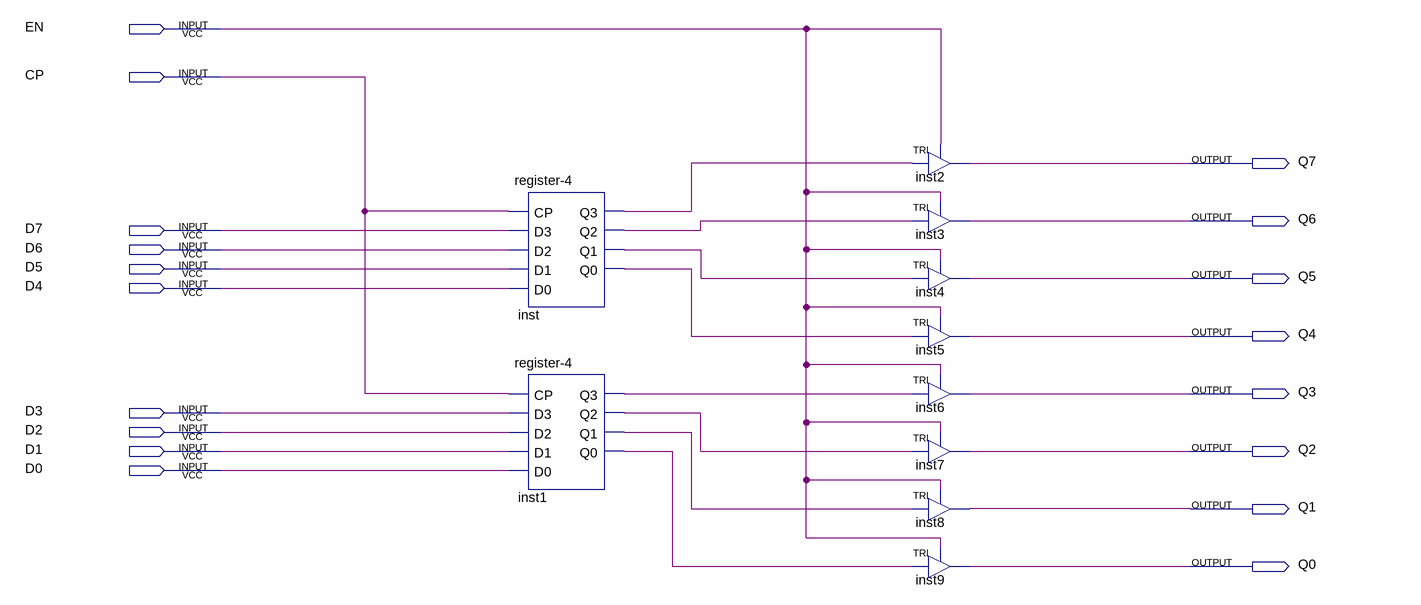
[diagram p0: schematic sheet]
// Quartus schematic register-8-en.bdf as structural Verilog: 10 symbols, 18 pins
module \register-8-en  (
  input  EN,
  input  CP,
  input  D7,
  input  D6,
  input  D5,
  input  D4,
  input  D3,
  input  D2,
  input  D1,
  input  D0,
  output Q7,
  output Q6,
  output Q5,
  output Q4,
  output Q3,
  output Q2,
  output Q1,
  output Q0
);

  wire inst1_q0, inst1_q1, inst1_q2, inst1_q3, inst_q0, inst_q1, inst_q2, inst_q3;

  \register-4  inst (
    .CP(CP), .D3(D7), .D2(D6), .D1(D5), .D0(D4), .Q3(inst_q3), .Q2(inst_q2), .Q1(inst_q1), .Q0(inst_q0));
  \register-4  inst1 (
    .CP(CP), .D3(D3), .D2(D2), .D1(D1), .D0(D0), .Q3(inst1_q3), .Q2(inst1_q2), .Q1(inst1_q1), .Q0(inst1_q0));
  TRI inst2 (.IN(inst_q3), .OE(EN), .OUT(Q7));
  TRI inst3 (.IN(inst_q2), .OE(EN), .OUT(Q6));
  TRI inst4 (.IN(inst_q1), .OE(EN), .OUT(Q5));
  TRI inst5 (.IN(inst_q0), .OE(EN), .OUT(Q4));
  TRI inst6 (.IN(inst1_q3), .OE(EN), .OUT(Q3));
  TRI inst7 (.IN(inst1_q2), .OE(EN), .OUT(Q2));
  TRI inst8 (.IN(inst1_q1), .OE(EN), .OUT(Q1));
  TRI inst9 (.IN(inst1_q0), .OE(EN), .OUT(Q0));
endmodule
